# EAGLE design 4att (EAGLE 7.7.0)
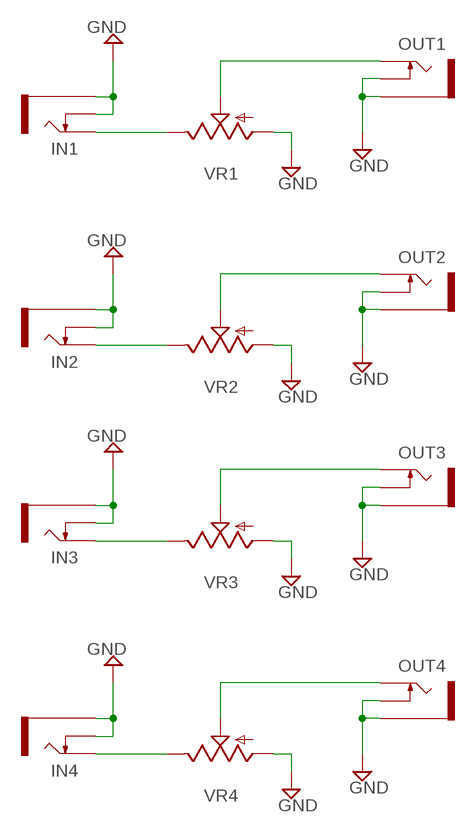
[diagram p0: schematic, sheet 1]

## Parts
IN1  THONKICONNNEW  [WQP-PJ301M-12_JACK]
IN2  THONKICONNNEW  [WQP-PJ301M-12_JACK]
IN3  THONKICONNNEW  [WQP-PJ301M-12_JACK]
IN4  THONKICONNNEW  [WQP-PJ301M-12_JACK]
OUT1  THONKICONNNEW  [WQP-PJ301M-12_JACK]
OUT2  THONKICONNNEW  [WQP-PJ301M-12_JACK]
OUT3  THONKICONNNEW  [WQP-PJ301M-12_JACK]
OUT4  THONKICONNNEW  [WQP-PJ301M-12_JACK]
VR1  9MM_SNAP-IN_POT_  [9MM_SNAP-IN_POT]
VR2  9MM_SNAP-IN_POT_  [9MM_SNAP-IN_POT]
VR3  9MM_SNAP-IN_POT_  [9MM_SNAP-IN_POT]
VR4  9MM_SNAP-IN_POT_  [9MM_SNAP-IN_POT]

## Nets
GND: IN1.P$2_SWITCH(SWITCH) IN1.P$3_SLEEVE(SLEEVE) IN2.P$2_SWITCH(SWITCH) IN2.P$3_SLEEVE(SLEEVE) IN3.P$2_SWITCH(SWITCH) IN3.P$3_SLEEVE(SLEEVE) IN4.P$2_SWITCH(SWITCH) IN4.P$3_SLEEVE(SLEEVE) OUT1.P$2_SWITCH(SWITCH) OUT1.P$3_SLEEVE(SLEEVE) OUT2.P$2_SWITCH(SWITCH) OUT2.P$3_SLEEVE(SLEEVE) OUT3.P$2_SWITCH(SWITCH) OUT3.P$3_SLEEVE(SLEEVE) OUT4.P$2_SWITCH(SWITCH) OUT4.P$3_SLEEVE(SLEEVE) VR1.1(A) VR2.1(A) VR3.1(A) VR4.1(A)
N$1: IN1.P$1_TIP(TIP) VR1.3(E)
N$2: OUT1.P$1_TIP(TIP) VR1.2(S)
N$3: IN2.P$1_TIP(TIP) VR2.3(E)
N$4: OUT2.P$1_TIP(TIP) VR2.2(S)
N$5: IN3.P$1_TIP(TIP) VR3.3(E)
N$6: OUT3.P$1_TIP(TIP) VR3.2(S)
N$7: IN4.P$1_TIP(TIP) VR4.3(E)
N$8: OUT4.P$1_TIP(TIP) VR4.2(S)

## Library data of the parts
IN1-IN4 OUT1-OUT4 = MusicThingModular:THONKICONN: 3.5mm socket for Eurorack modular synths
VR1-VR4 = MusicThingModular:9MM_SNAP-IN_POT: 9mm vertical snap-in pot, Alpha / Panasonic style

## Board
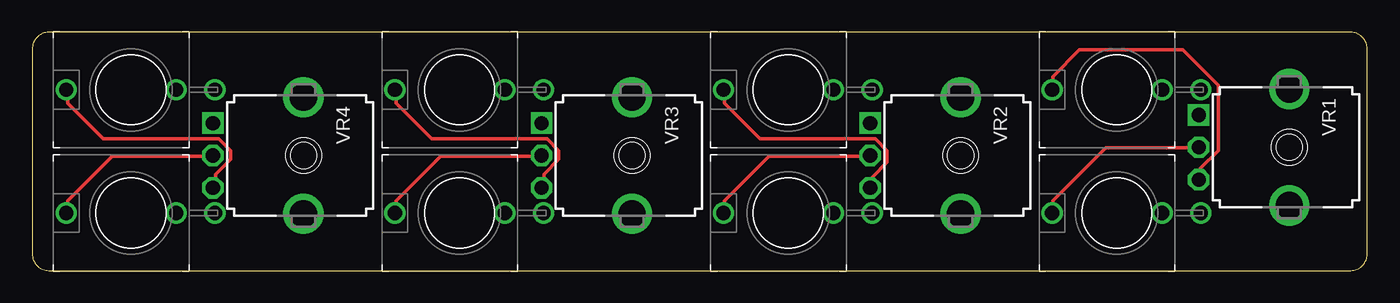
[diagram p1: board, top side]
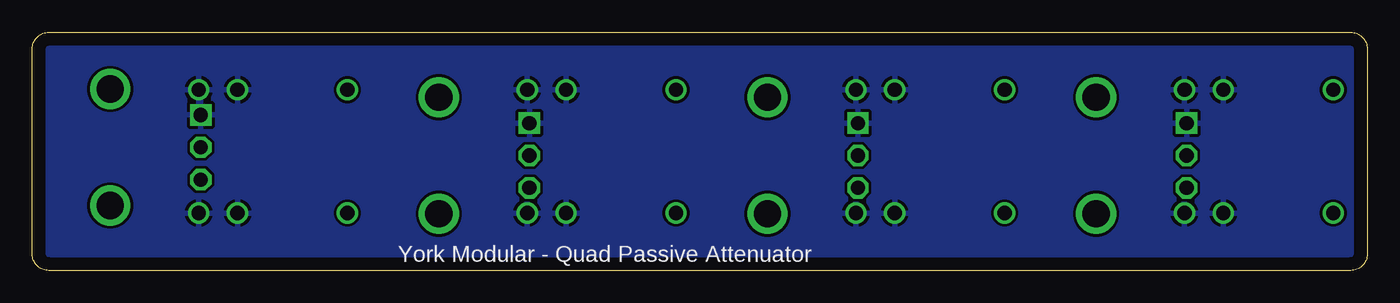
[diagram p2: board, bottom side, seen from below]

Size 103.17 x 18.41 mm. Coordinates in mm from the lower left corner, seen from the top.
Outline: 1.27,0 101.91,0 arc90 103.17,1.27 103.17,17.14 arc90 101.91,18.41 1.27,18.41 arc90 0,17.14 0,1.27 arc90 1.27,0
Copper layers (1*16): Top 0.035mm / dielectric 1.5mm / Bottom 0.035mm
Design rules "default": minimum track width 10mil, minimum drill 24mil, track to track 8mil, track to pad 8mil, pad to pad 8mil, via to via 8mil, smd to smd 8mil, copper to edge 40mil, drill to drill 8mil, minimum pad ring 10mil, minimum via ring 8mil, stop-mask expansion 4mil, vias tented up to drill 0mil, thermal gap 10mil

### Footprints (pad centres in the part's own frame; a part is rotated, then mirrored left to right if it is on the bottom)
WQP-PJ301M-12_JACK = drill 1.1: P$1_TIP 0,5; P$2_SWITCH 0,-3.5; P$3_SLEEVE 0,-6.5
9MM_SNAP-IN_POT = drill 1.1 square: 1 -2.5,-7 | drill 1.1 octagon: 2 0,-7; 3 2.5,-7 | drill 2.1 pad 2.794: CHASSIS1 -4.5,0; CHASSIS2 4.5,0

### Placement (x,y rotation side)
IN1  83.82,13.97 90 top
IN2  58.42,13.97 90 top
IN3  33.02,13.97 90 top
IN4  7.62,13.97 90 top
OUT1  83.82,4.45 90 top
OUT2  58.42,4.45 90 top
OUT3  33.02,4.45 90 top
OUT4  7.62,4.45 90 top
VR1  97.16,9.52 270 top
VR2  71.75,8.89 270 top
VR3  46.35,8.89 270 top
VR4  20.95,8.89 270 top

### Tracks (layer width: path | path; a pad name or v marks a point on that pad's centre or on a via)
GND
  pour Bottom: -1.27,26.67 106.68,26.67 106.68,-10.16 -1.27,-10.16
N$1
  Top 0.254: VR1.3 90.3,7.21 90.3,7.9 91.67,9.27 91.67,14.3 88.92,17.04 80.92,17.04 78.87,14.99 78.87,14.07 IN1.P$1_TIP
N$2
  Top 0.254: OUT1.P$1_TIP 78.87,4.47 78.87,5.38 82.98,9.5 90.07,9.5 VR1.2
N$3
  Top 0.254: VR2.3 64.92,6.53 64.92,7.21 66.06,8.36 66.06,9.27 65.15,10.18 56.24,10.18 53.49,12.93 53.49,13.84 IN2.P$1_TIP
N$4
  Top 0.254: OUT2.P$1_TIP 53.49,4.47 53.49,5.38 56.92,8.81 64.69,8.81 VR2.2
N$5
  Top 0.254: VR3.3 39.55,6.53 39.55,7.44 40.69,8.59 40.69,9.27 39.78,10.18 30.86,10.18 28.12,12.93 28.12,13.84 IN3.P$1_TIP
N$6
  Top 0.254: OUT3.P$1_TIP 28.12,4.47 28.12,5.38 31.55,8.81 39.32,8.81 VR3.2
N$7
  Top 0.254: VR4.3 14.17,6.53 14.17,7.44 15.32,8.59 15.32,9.27 14.4,10.18 5.49,10.18 2.74,12.93 2.74,13.84 IN4.P$1_TIP
N$8
  Top 0.254: OUT4.P$1_TIP 2.74,4.47 2.74,5.38 6.17,8.81 13.95,8.81 VR4.2

### Text on the board
bNames: York Modular - Quad Passive Attenuator